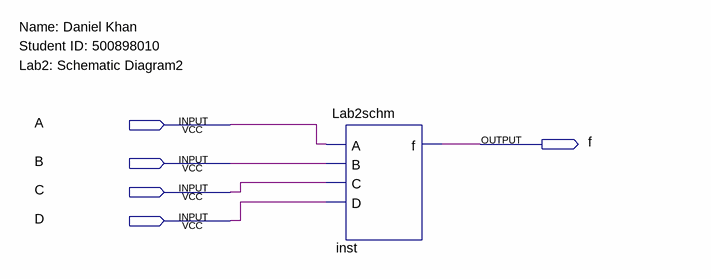
[diagram p0: schematic sheet]
// Quartus schematic LAB2SCHEM2.bdf as structural Verilog: 1 symbols, 5 pins
module LAB2SCHEM2 (
  input  A,
  input  B,
  input  C,
  input  D,
  output f
);

  Lab2schm inst (.A(A), .B(B), .C(C), .D(D), .f(f));

  // Notes on the sheet:
  //   Name: Daniel Khan
  //   Student ID: 500898010
  //   Lab2: Schematic Diagram2
endmodule
